# Altium schematic sheet SW.SchDoc
size A
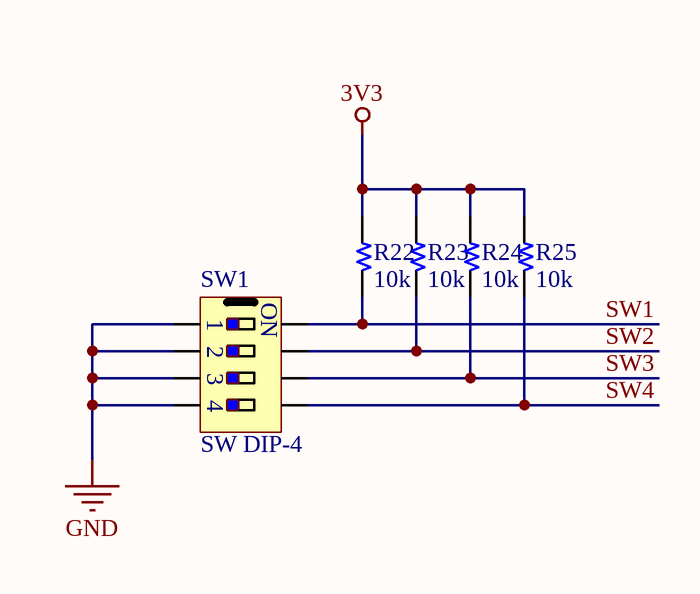
[diagram p0: SW.SchDoc]

## Parts
R22  10k  [R 0603]
R23  10k  [R 0603]
R24  10k  [R 0603]
R25  10k  [R 0603]
SW1  SW DIP-4  [SW/DIP4]

## Nets
3V3: R22.2 R23.2 R24.2 R25.2
GND: SW1.1 SW1.2 SW1.3 SW1.4
SW1: R22.1 SW1.8
SW2: R23.1 SW1.7
SW3: R24.1 SW1.6
SW4: R25.1 SW1.5

## Notes on the sheet
- (in symbol SW DIP-4) ON

## Library data of the parts
R22-R25 = Resistor